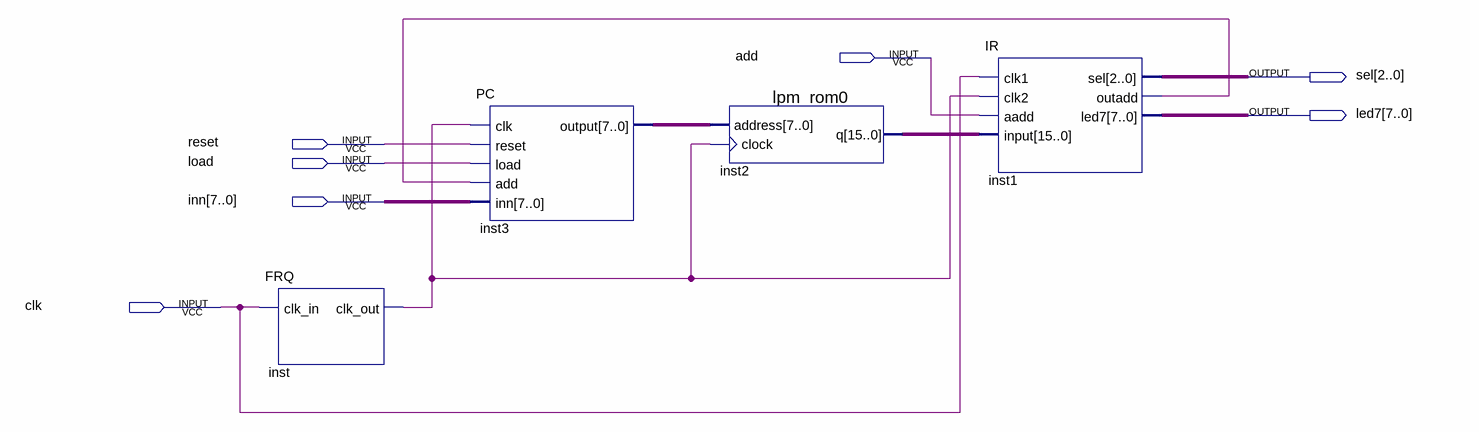
[diagram p0: schematic sheet]
// Quartus schematic shiyan7.bdf as structural Verilog: 4 symbols, 7 pins
module shiyan7 (
  input  add,
  input  reset,
  input  load,
  input  [7:0] inn,
  input  clk,
  output [2:0] sel,
  output [7:0] led7
);

  wire inst1_outadd, inst_clk_out;
  wire [7:0] inst3_output;
  wire [15:0] inst2_q;

  FRQ inst (.clk_in(clk), .clk_out(inst_clk_out));
  PC inst3 (.clk(inst_clk_out), .reset(reset), .load(load), .add(inst1_outadd), .inn(inn), .\output (inst3_output));
  lpm_rom0 inst2 (.address(inst3_output), .clock(inst_clk_out), .q(inst2_q));
  IR inst1 (
    .clk1(clk), .clk2(inst_clk_out), .aadd(add), .\input (inst2_q), .sel(sel), .outadd(inst1_outadd),
    .led7(led7));
endmodule
